# Altium project OBD-II-Based-HM-13.PrjPcb
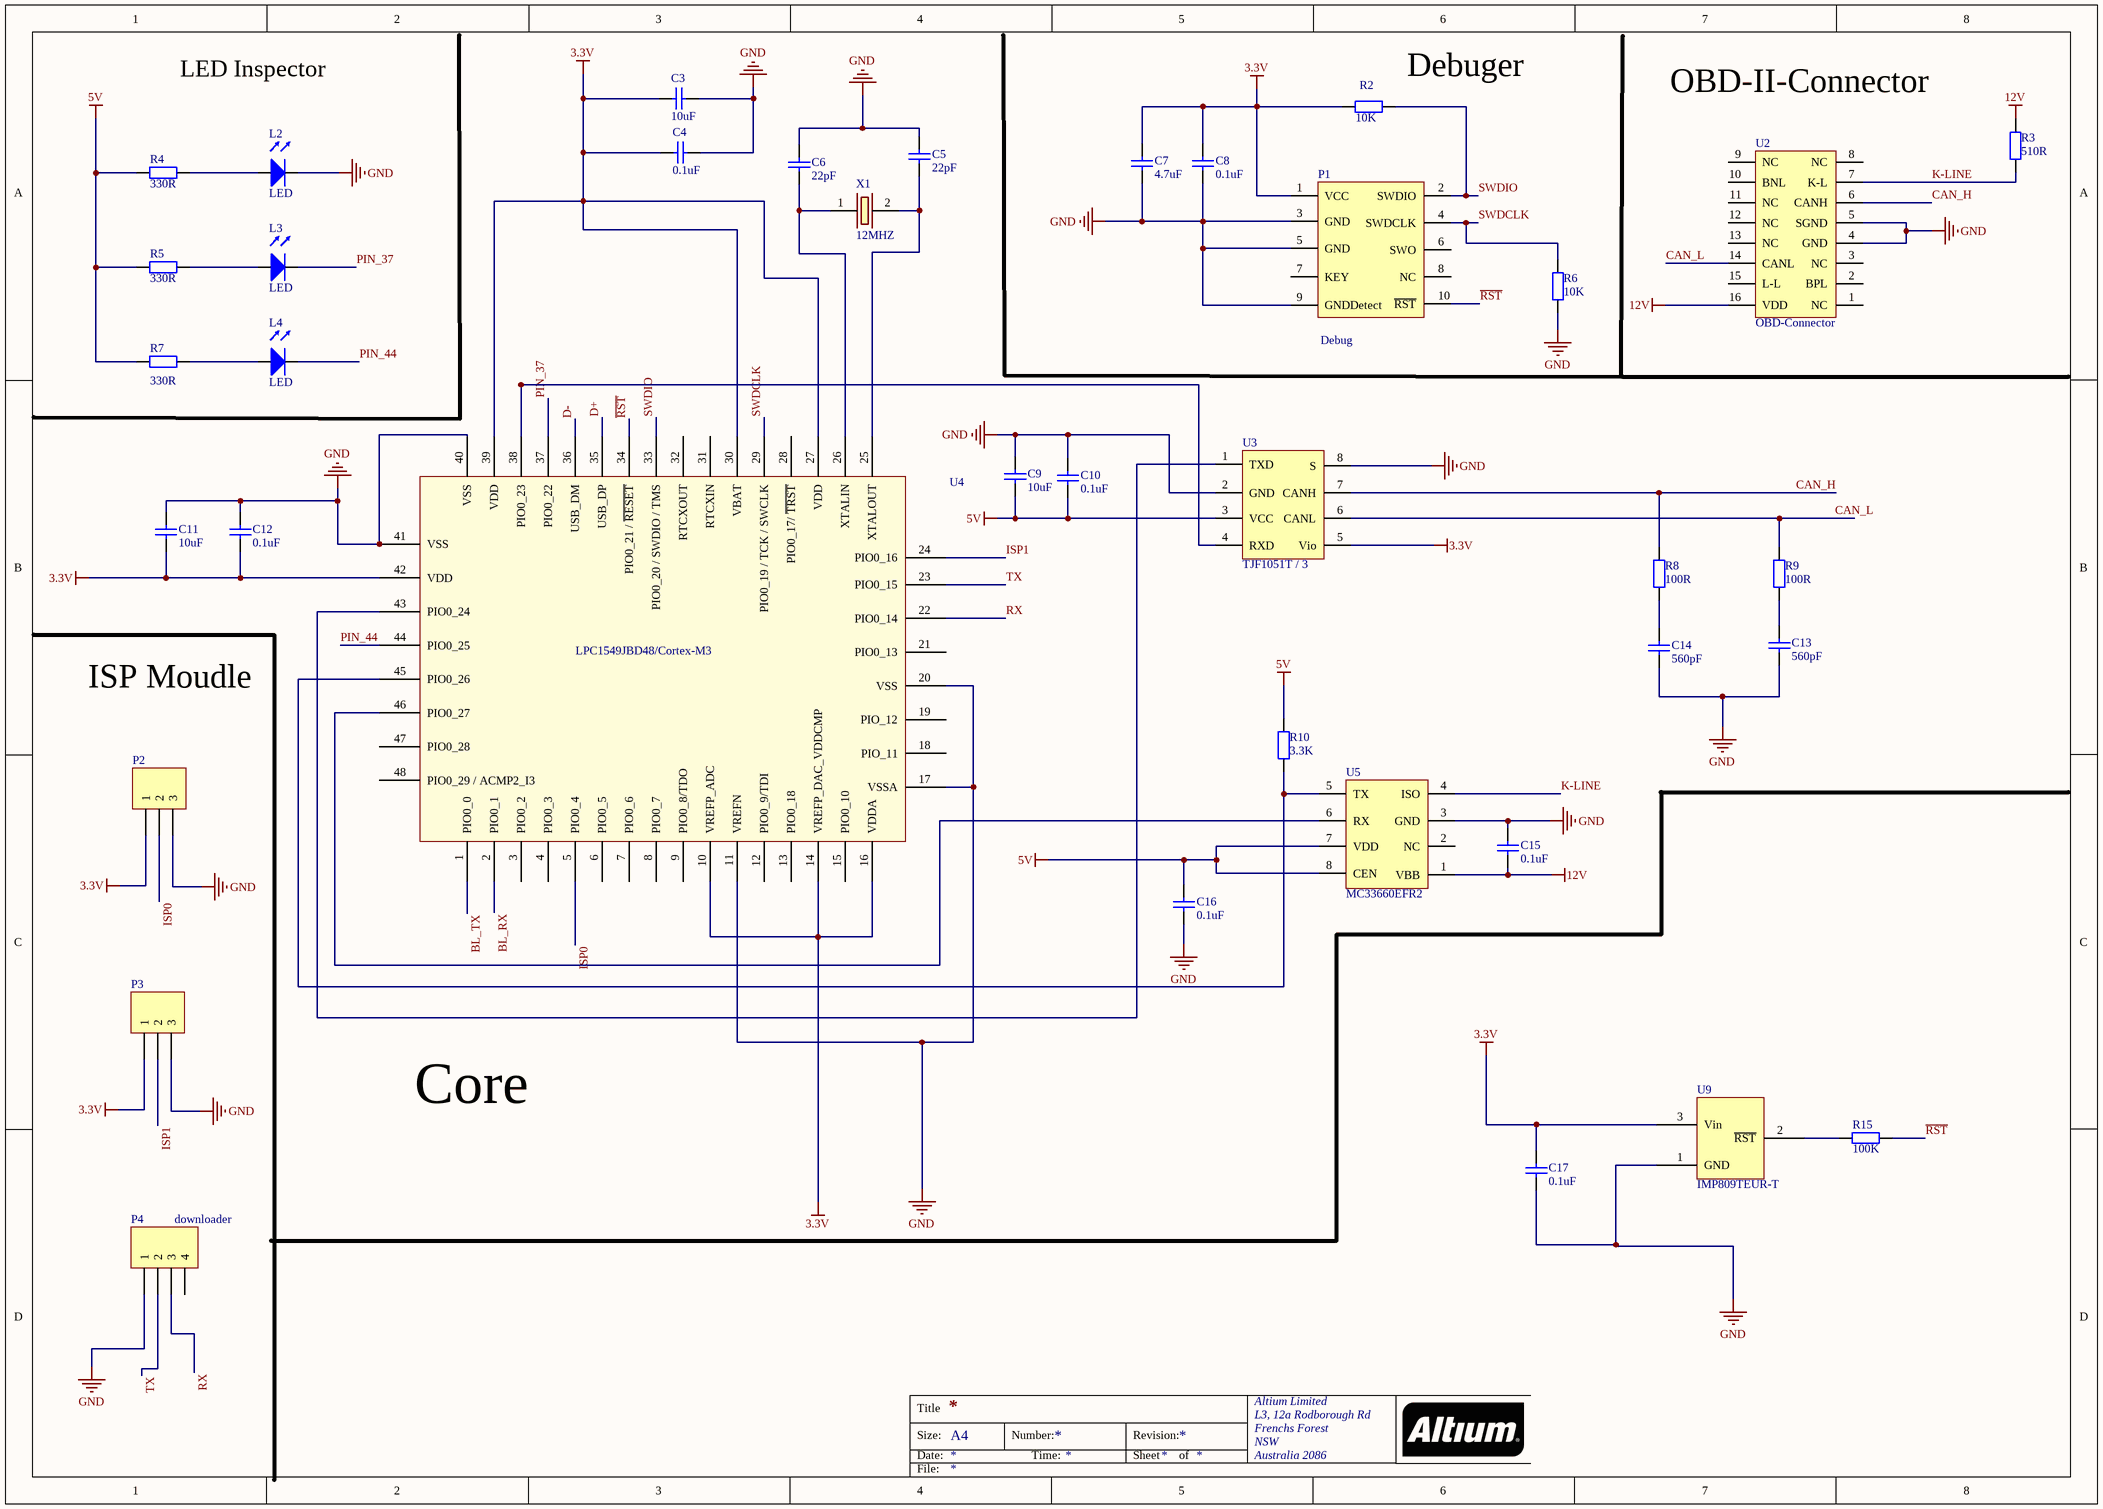
[diagram p0: Core.SchDoc]
3 sheets, 55 parts. Net scope: global (net labels, ports and power ports of the same name join across sheets).
Board file: OBD-II.PcbDoc
Sheets:
  Core.SchDoc
  Power.SchDoc
  USB.SchDoc

## Sheet Core.SchDoc
size A3; Organization: Altium Limited; Address1: L3, 12a Rodborough Rd; Address2: Frenchs Forest; Address3: NSW; Address4: Australia 2086

### Parts
C3  10uF  [0603]
C4  0.1uF  [0603]
C5  22pF  [0603]
C6  22pF  [0603]
C7  4.7uF  [0603]
C8  0.1uF  [0603]
C9  10uF  [0603]
C10  0.1uF  [0603]
C11  10uF  [0603]
C12  0.1uF  [0603]
C13  560pF  [0603]
C14  560pF  [0603]
C15  0.1uF  [0603]
C16  0.1uF  [0603]
C17  0.1uF  [0603]
L2  LED  [0805]
L3  LED  [0805]
L4  LED  [0805]
P1  Debug  [JATG_10pin]
P2  (no value)  [HDR1X3]
P3  (no value)  [HDR1X3]
P4  downloader  [HDR1X4]
R2  10K  [0603]
R3  510R  [0603]
R4  330R  [0603]
R5  330R  [0603]
R6  10K  [0603]
R7  330R  [0603]
R8  100R  [0603]
R9  100R  [0603]
R10  3.3K  [0603]
R15  100K  [0603]
U2  OBD-Connector  [OBD-MaleConnector]
U3  TJF1051T / 3  [TJF1051]
U4  LPC1549  [LPC1549JBD48]  (value not drawn)
U5  MC33660EFR2  [SOP-8]
U9  IMP809TEUR-T  [SOT23-3]
X1  12MHZ  [12Mhz-DFN]

### Nets
3.3V: C3.2 C4.2 C7.2 C8.2 C11.1 C12.1 C17.2 P1.1(VCC) P2.1 P3.1 R2.1 U3.5(Vio) U4.10(VREFP_ADC) U4.14(VREFP_DAC_VDDCMP) U4.16(VDDA) U4.27(VDD) U4.30(VBAT) U4.39(VDD) U4.42(VDD) U9.3(Vin)
5V: C9.1 C10.1 C16.2 R4.1 R5.1 R7.1 R10.2 U3.3(VCC) U5.7(VDD) U5.8(CEN)
12V: C15.1 R3.2 U2.16(VDD) U5.1(VBB)
GND: C3.1 C4.1 C5.2 C6.2 C7.1 C8.1 C9.2 C10.2 C11.2 C12.2 C13.1 C14.1 C15.2 C16.1 C17.1 L2.2(K) P1.3(GND) P1.5(GND) P1.9(GNDDetect) P2.3 P3.3 P4.1 R6.1 U2.4(GND) U2.5(SGND) U3.2(GND) U3.8(S) U4.11(VREFN) U4.17(VSSA) U4.20(VSS) U4.40(VSS) U4.41(VSS) U5.3(GND) U9.1(GND)
BL_RX: U4.2(PIO0_1)
BL_TX: U4.1(PIO0_0)
CAN_H: R8.2 U2.6(CANH) U3.7(CANH)
CAN_L: R9.2 U2.14(CANL) U3.6(CANL)
D+: U4.35(USB_DP)
D-: U4.36(USB_DM)
ISP0: P2.2 U4.5(PIO0_4)
ISP1: P3.2 U4.24(PIO0_16)
K-LINE: R3.1 U2.7(K-L) U5.4(ISO)
PIN_37: L3.2(K) U4.37(PIO0_22)
PIN_44: L4.2(K) U4.44(PIO0_25)
~{RST}: P1.10(~{RST}) R15.1 U4.34(PIO0_21_/_~{RESET})
RX: P4.3 U4.22(PIO0_14)
SWDCLK: P1.4(SWDCLK) R6.2 U4.29(PIO0_19_/_TCK_/_SWCLK)
SWDIO: P1.2(SWDIO) R2.2 U4.33(PIO0_20_/_SWDIO_/_TMS)
TX: P4.2 U4.23(PIO0_15)
NetC5_1: C5.1 U4.25(XTALOUT) X1.2
NetC6_1: C6.1 U4.26(XTALIN) X1.1
NetC13_2: C13.2 R9.1
NetC14_2: C14.2 R8.1
NetL2_1: L2.1(A) R4.2
NetL3_1: L3.1(A) R5.2
NetL4_1: L4.1(A) R7.2
NetR10_1: R10.1 U4.45(PIO0_26) U5.5(TX)
NetR15_2: R15.2 U9.2(~{RST})
NetU3_1: U3.1(TXD) U4.43(PIO0_24)
NetU3_4: U3.4(RXD) U4.38(PIO0_23)
NetU4_46: U4.46(PIO0_27) U5.6(RX)

Not connected (* = marked no-connect by the designer): P1 6(SWO) 7(KEY) 8(NC); P4 4; U2 1(NC) 2(BPL) 3(NC) 8(NC) 9(NC) 10(BNL) 11(NC) 12(NC) 13(NC) 15(L-L); U4 3(PIO0_2) 4(PIO0_3) 6(PIO0_5) 7(PIO0_6) 8(PIO0_7) 9(PIO0_8/TDO) 12(PIO0_9/TDI) 13(PIO0_18) 15(PIO0_10) 18(PIO_11) 19(PIO_12) 21(PIO0_13) 28(PIO0_17/_~{TRST}) 31(RTCXIN) 32(RTCXOUT) 47(PIO0_28) 48(PIO0_29_/_ACMP2_I3); U5 2(NC)

### Notes on the sheet
- LED Inspector
- (near R2) Debuger
- OBD-II-Connector
- ISP Moudle
- Core
- Title
- Size:
- Date:
- A4
- Number:
- Time:
- Revision:
- Sheet
- of
- File:
- (in symbol LPC1549JBD48) LPC1549JBD48/Cortex-M3

### Library data of the parts
C3-C17 = Cap1: ceramic
P1 = JTAG_10Pin
P2 P3 = Header 3: Header, 3-Pin; LatestRevisionDate: 17-Jul-2002; LatestRevisionNote: Re-released for DXP Platform.; Publisher: Altium Limited
P4 = Header 4: Header, 4-Pin; LatestRevisionDate: 17-Jul-2002; LatestRevisionNote: Re-released for DXP Platform.; Publisher: Altium Limited
R2-R10 R15 = Res
U2 = OBD-MaleHead
U4 = LPC1549JBD48
X1 = OSC

## Sheet Power.SchDoc
size A4; Organization: Altium Limited; Address1: L3, 12a Rodborough Rd; Address2: Frenchs Forest; Address3: NSW; Address4: Australia 2086
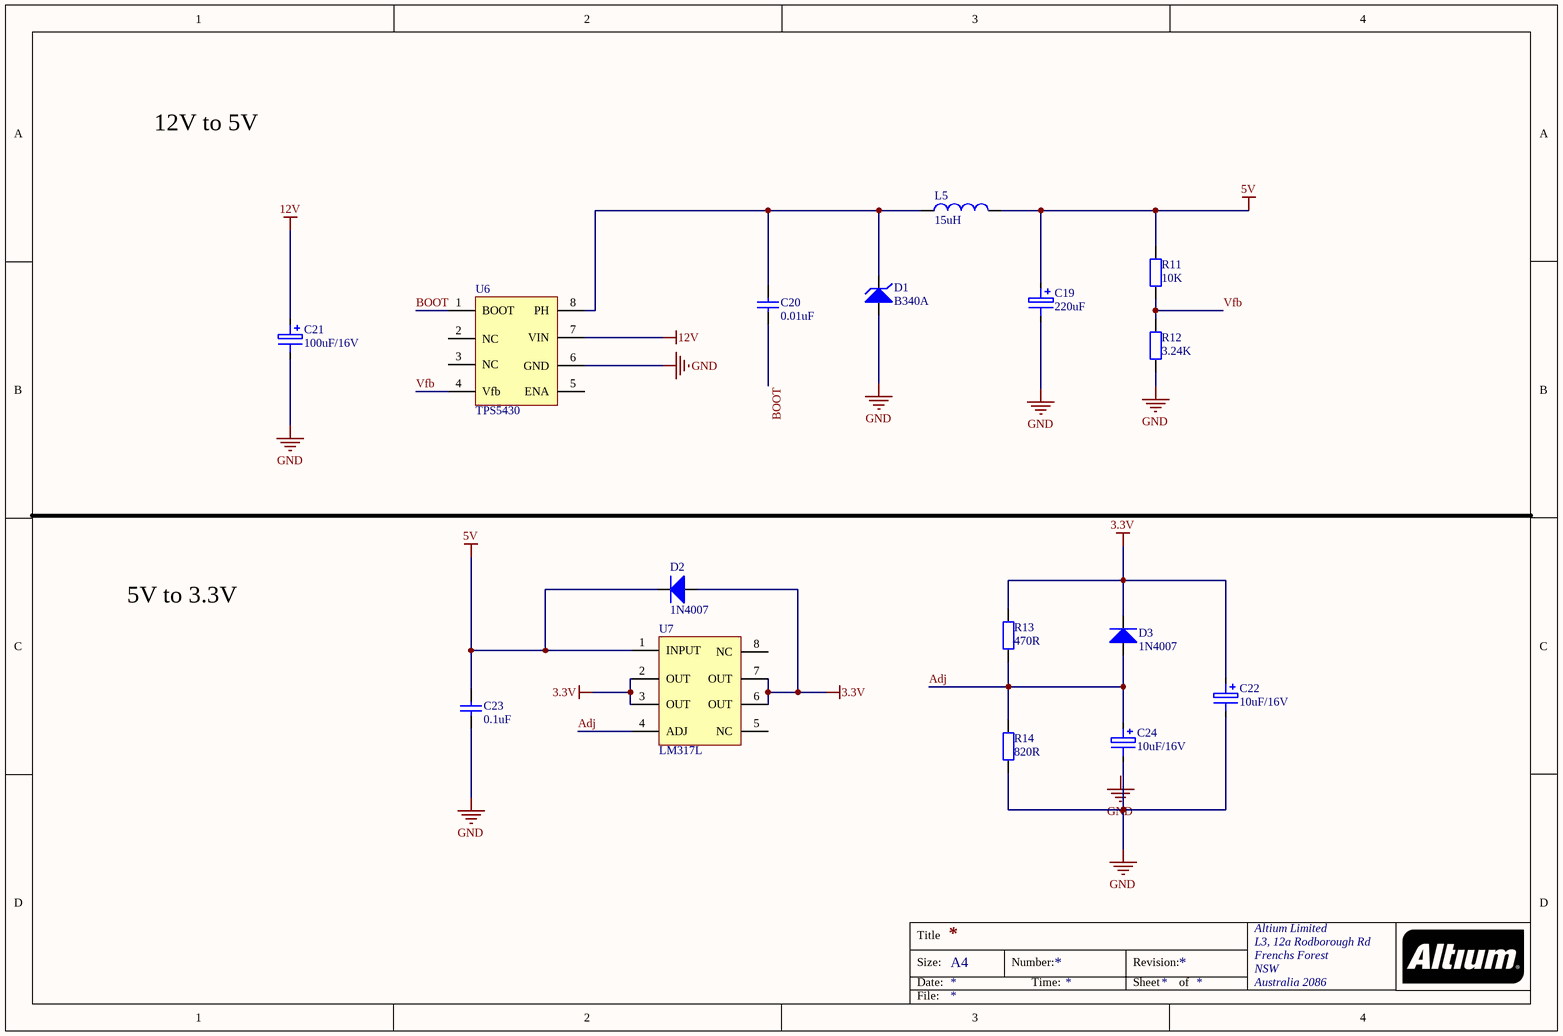
[diagram p1: Power.SchDoc]

### Parts
C19  220uF  [CAPM-7.0*4.5]
C20  0.01uF  [0603]
C21  100uF/16V  [CAPM-7.0*4.5]
C22  10uF/16V  [CAPM-5.5*3.3]
C23  0.1uF  [0603]
C24  10uF/16V  [CAPM-5.5*3.3]
D1  B340A  [DO214-AC]
D2  1N4007  [DO214-AC]
D3  1N4007  [DO214-AC]
L5  15uH  [7*7*4-15uH]
R11  10K  [0603]
R12  3.24K  [0603]
R13  470R  [0603]
R14  820R  [0603]
U6  TPS5430  [TPS5430]
U7  LM317L  [LM317L]

### Nets
3.3V: C22.1 D2.1(A) D3.2(K) R13.2 U7.2(OUT) U7.3(OUT) U7.6(OUT) U7.7(OUT)
5V: C19.1 C23.2 D2.2(K) L5.2 R11.2 U7.1(INPUT)
12V: C21.1 U6.7(VIN)
GND: C19.2 C21.2 C22.2 C23.1 C24.2 D1.1(A) R12.1 R14.1 U6.6(GND)
Adj: C24.1 D3.1(A) R13.1 R14.2 U7.4(ADJ)
BOOT: C20.1 U6.1(BOOT)
Vfb: R11.1 R12.2 U6.4(Vfb)
NetC20_2: C20.2 D1.2(K) L5.1 U6.8(PH)

Not connected (* = marked no-connect by the designer): U6 2(NC) 3(NC) 5(ENA); U7 5(NC) 8(NC)

### Notes on the sheet
- 12V to 5V
- 5V to 3.3V
- Labels drawn without touching a wire or pin: GND
- Title
- Size:
- Date:
- A4
- Number:
- Time:
- Revision:
- Sheet
- of
- File:

### Library data of the parts
C19 C21 C22 C24 = Cap3: aluminum
C20 C23 = Cap1: ceramic
D1 = B340A-13-F
L5 = Inductor
R11-R14 = Res

## Sheet USB.SchDoc
size A4; Organization: Altium Limited; Address1: L3, 12a Rodborough Rd; Address2: Frenchs Forest; Address3: NSW; Address4: Australia 2086
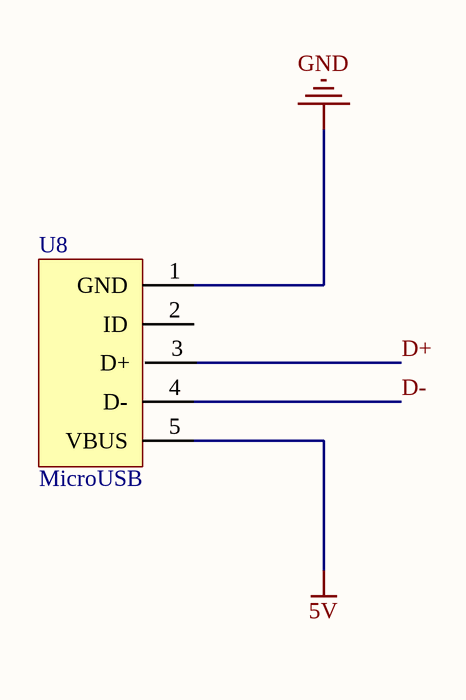
[diagram p2: USB.SchDoc]

### Parts
U8  MicroUSB  [Micro-USB]

### Nets
5V: U8.5(VBUS)
GND: U8.1(GND)
D+: U8.3(D+)
D-: U8.4(D-)

Not connected (* = marked no-connect by the designer): U8 2(ID)

### Notes on the sheet
- Title
- Size:
- Date:
- A4
- Number:
- Time:
- Revision:
- Sheet
- of
- File:

### Library data of the parts
U8 = MicroUSB_B

## Nets that join several sheets
3.3V: Core (20 pins), Power (8 pins)
5V: Core (10 pins), Power (6 pins), USB (U8.5)
12V: Core (C15.1 R3.2 U2.16 U5.1), Power (C21.1 U6.7)
GND: Core (34 pins), Power (9 pins), USB (U8.1)
D+: Core (U4.35), USB (U8.3)
D-: Core (U4.36), USB (U8.4)